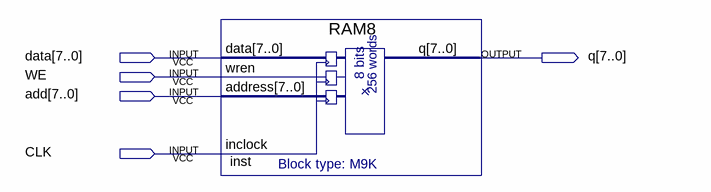
[diagram p0: schematic sheet]
// Quartus schematic RAM_test.bdf as structural Verilog: 1 symbols, 5 pins
module RAM_test (
  input  [7:0] data,
  input  WE,
  input  [7:0] add,
  input  CLK,
  output [7:0] q
);

  RAM8 inst (.data(data), .wren(WE), .address(add), .inclock(CLK), .q(q));
endmodule
